# Altium schematic sheet controller.SchDoc
size A
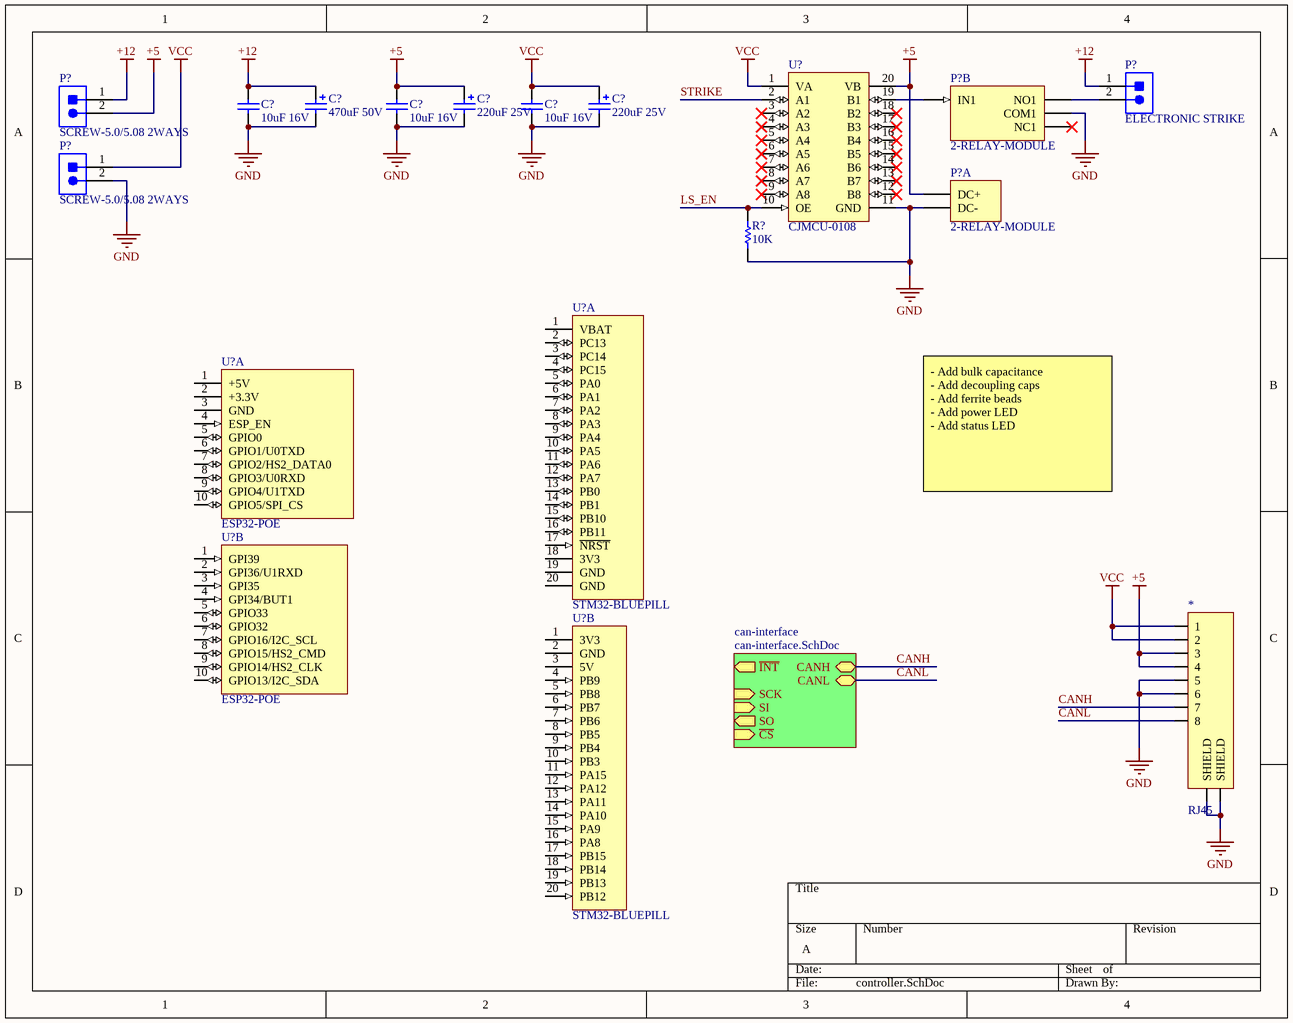
[diagram p0: controller.SchDoc]

## Parts
(Parts that share a designator on the sheet are numbered #1, #2 ... from top to bottom, then left to right.)
*  RJ45
C?#1  470uF 50V  [RB7.6-15]
C?#2  220uF 25V  [RB7.6-15]
C?#3  220uF 25V  [RB7.6-15]
C?#4  10uF 16V  [CAPC0805(2012)145_L]
C?#5  10uF 16V  [CAPC0805(2012)145_L]
C?#6  10uF 16V  [CAPC0805(2012)145_L]
P?#1  ELECTRONIC STRIKE  [SCREW-5.0-2WAYS_V]
P?#2  SCREW-5.0/5.08 2WAYS  [SCREW-5.0-2WAYS_V]
P?#3  2-RELAY-MODULE  (part B of 3)
P?#4  SCREW-5.0/5.08 2WAYS  [SCREW-5.0-2WAYS_V]
P?#5  2-RELAY-MODULE  (part A of 3)
R?  10K  [RESC0603(1608)_N]
U?#1  CJMCU-0108
U?#2  STM32-BLUEPILL  (part A of 2)
U?#3  ESP32-POE  (part A of 2)
U?#4  ESP32-POE  (part B of 2)
U?#5  STM32-BLUEPILL  (part B of 2)

## Sub-sheets
can-interface = can-interface.SchDoc: SO (out), SI (in), CANH (bidir), ~{CS} (in), CANL (bidir), SCK (in), ~{INT} (out)

## Nets
+5: *.3 *.4 C?#2.1 C?#5.2 P?#2.2 P?#5.1(DC+) U?#1.20(VB)
+12: C?#1.1 C?#4.2 P?#1.1 P?#2.1
GND: *.5 *.6 *.9(SHIELD) *.10(SHIELD) C?#1.2 C?#2.2 C?#3.2 C?#4.1 C?#5.1 C?#6.1 P?#3.3(COM1) P?#4.2 P?#5.2(DC-) R?.1 U?#1.11(GND)
VCC: *.1 *.2 C?#3.1 C?#6.2 P?#4.1 U?#1.1(VA)
CANH: *.7 ; sheet can-interface/CANH
CANL: *.8 ; sheet can-interface/CANL
LS_EN: R?.2 U?#1.10(OE)
STRIKE: U?#1.2(A1)
NetP?#1_2: P?#1.2 P?#3.2(NO1)
NetP?#3_1: P?#3.1(IN1) U?#1.19(B1)

Not connected (* = marked no-connect by the designer): P?#3 4(NC1)*; U?#1 3(A2)* 4(A3)* 5(A4)* 6(A5)* 7(A6)* 8(A7)* 9(A8)* 12(B8)* 13(B7)* 14(B6)* 15(B5)* 16(B4)* 17(B3)* 18(B2)*; U?#2 1(VBAT) 2(PC13) 3(PC14) 4(PC15) 5(PA0) 6(PA1) 7(PA2) 8(PA3) 9(PA4) 10(PA5) 11(PA6) 12(PA7) 13(PB0) 14(PB1) 15(PB10) 16(PB11) 17(~{NRST}) 18(3V3) 19(GND) 20(GND); U?#3 1(+5V) 2(+3.3V) 3(GND) 4(ESP_EN) 5(GPIO0) 6(GPIO1/U0TXD) 7(GPIO2/HS2_DATA0) 8(GPIO3/U0RXD) 9(GPIO4/U1TXD) 10(GPIO5/SPI_CS); U?#4 1(GPI39) 2(GPI36/U1RXD) 3(GPI35) 4(GPI34/BUT1) 5(GPIO33) 6(GPIO32) 7(GPIO16/I2C_SCL) 8(GPIO15/HS2_CMD) 9(GPIO14/HS2_CLK) 10(GPIO13/I2C_SDA); U?#5 1(3V3) 2(GND) 3(5V) 4(PB9) 5(PB8) 6(PB7) 7(PB6) 8(PB5) 9(PB4) 10(PB3) 11(PA15) 12(PA12) 13(PA11) 14(PA10) 15(PA9) 16(PA8) 17(PB15) 18(PB14) 19(PB13) 20(PB12)

## Notes on the sheet
- - Add bulk capacitance
  - Add decoupling caps
  - Add ferrite beads
  - Add power LED
  - Add status LED

## Library data of the parts
C?#1-C?#3 = Cap Pol1: Polarized Capacitor (Radial); Published: 8-Jun-2000; LatestRevisionDate: 17-Jul-2002; LatestRevisionNote: Re-released for DXP Platform.; PackageReference: RB7.6-15; Publisher: Altium Limited; PackageDescription: Polarized Capacitor (Radial); 2 Leads
  C?#1: Value: 470uF
  C?#2 C?#3: Value: 220uF
C?#4-C?#6 = CMP-1036-04927-1: CAP 10uF 16V ±10% 0805 (2012 Metric) Thickness 1.45mm SMD; Case-EIA: 0805; Tolerance: Â±10%; Case-Metric: 2012; Rated Voltage: 16 V; Technology: SMT; Value: 10uF; Max Thickness: 1.45 mm
P?#1 = CMP-0617-00009-1: Socket, Screw Terminal Block, 2 Way, 5.0 mm Pitch, 90 Degree Angle, Through-Hole; PartNumber: SCREW-5.0/5.08 2WAYS; Manufacturer: No Vendor; Insulation Resistance: 5000 MOhm / 1000 V; Contact Resistance: 20 mOhm; Rated Current: 25 A; Poles: 2; Rated Voltage: 300 V; ComponentLink1Description: Datasheet; ComponentLink1URL: 5mm screw terminal in SVN; Mounting Technology: Through Hole; PackageDescription: Socket, Screw Terminal Block, 2 Way, Pitch 5 mm, 90 Degree Angle, Through-Hole; Temperature Range: -40 to 105 degC
P?#2 P?#4 = CMP-0617-00009-1: Socket, Screw Terminal Block, 2 Way, 5.0 mm Pitch, 90 Degree Angle, Through-Hole; Manufacturer: No Vendor; Insulation Resistance: 5000 MOhm / 1000 V; Contact Resistance: 20 mOhm; Rated Current: 25 A; Poles: 2; Rated Voltage: 300 V; PartNumber: SCREW-5.0/5.08 2WAYS; ComponentLink1Description: Datasheet; ComponentLink1URL: 5mm screw terminal in SVN; Mounting Technology: Through Hole; PackageDescription: Socket, Screw Terminal Block, 2 Way, Pitch 5 mm, 90 Degree Angle, Through-Hole; Temperature Range: -40 to 105 degC
P?#3 P?#5 = 2-RELAY-MODULE: Dual relay module
R? = CMP-1012-00098-1: 10K 0.1W 5% 0603 (1608 Metric)  SMD; Case-EIA: 0603; Value: 10000.00 Ohm; Case-Metric: 1608; Technology: SMT; Tolerance: 5 %; Power: 0.1 W
U?#1 = CJMCU-0108: TXS0108E 8 channel logic level converter
U?#2 U?#5 = STM32-BLUEPILL: STM32 Bluepill
U?#3 U?#4 = ESP32-POE: Olimex ESP32-POE